# Altium project Altium.PrjPcb
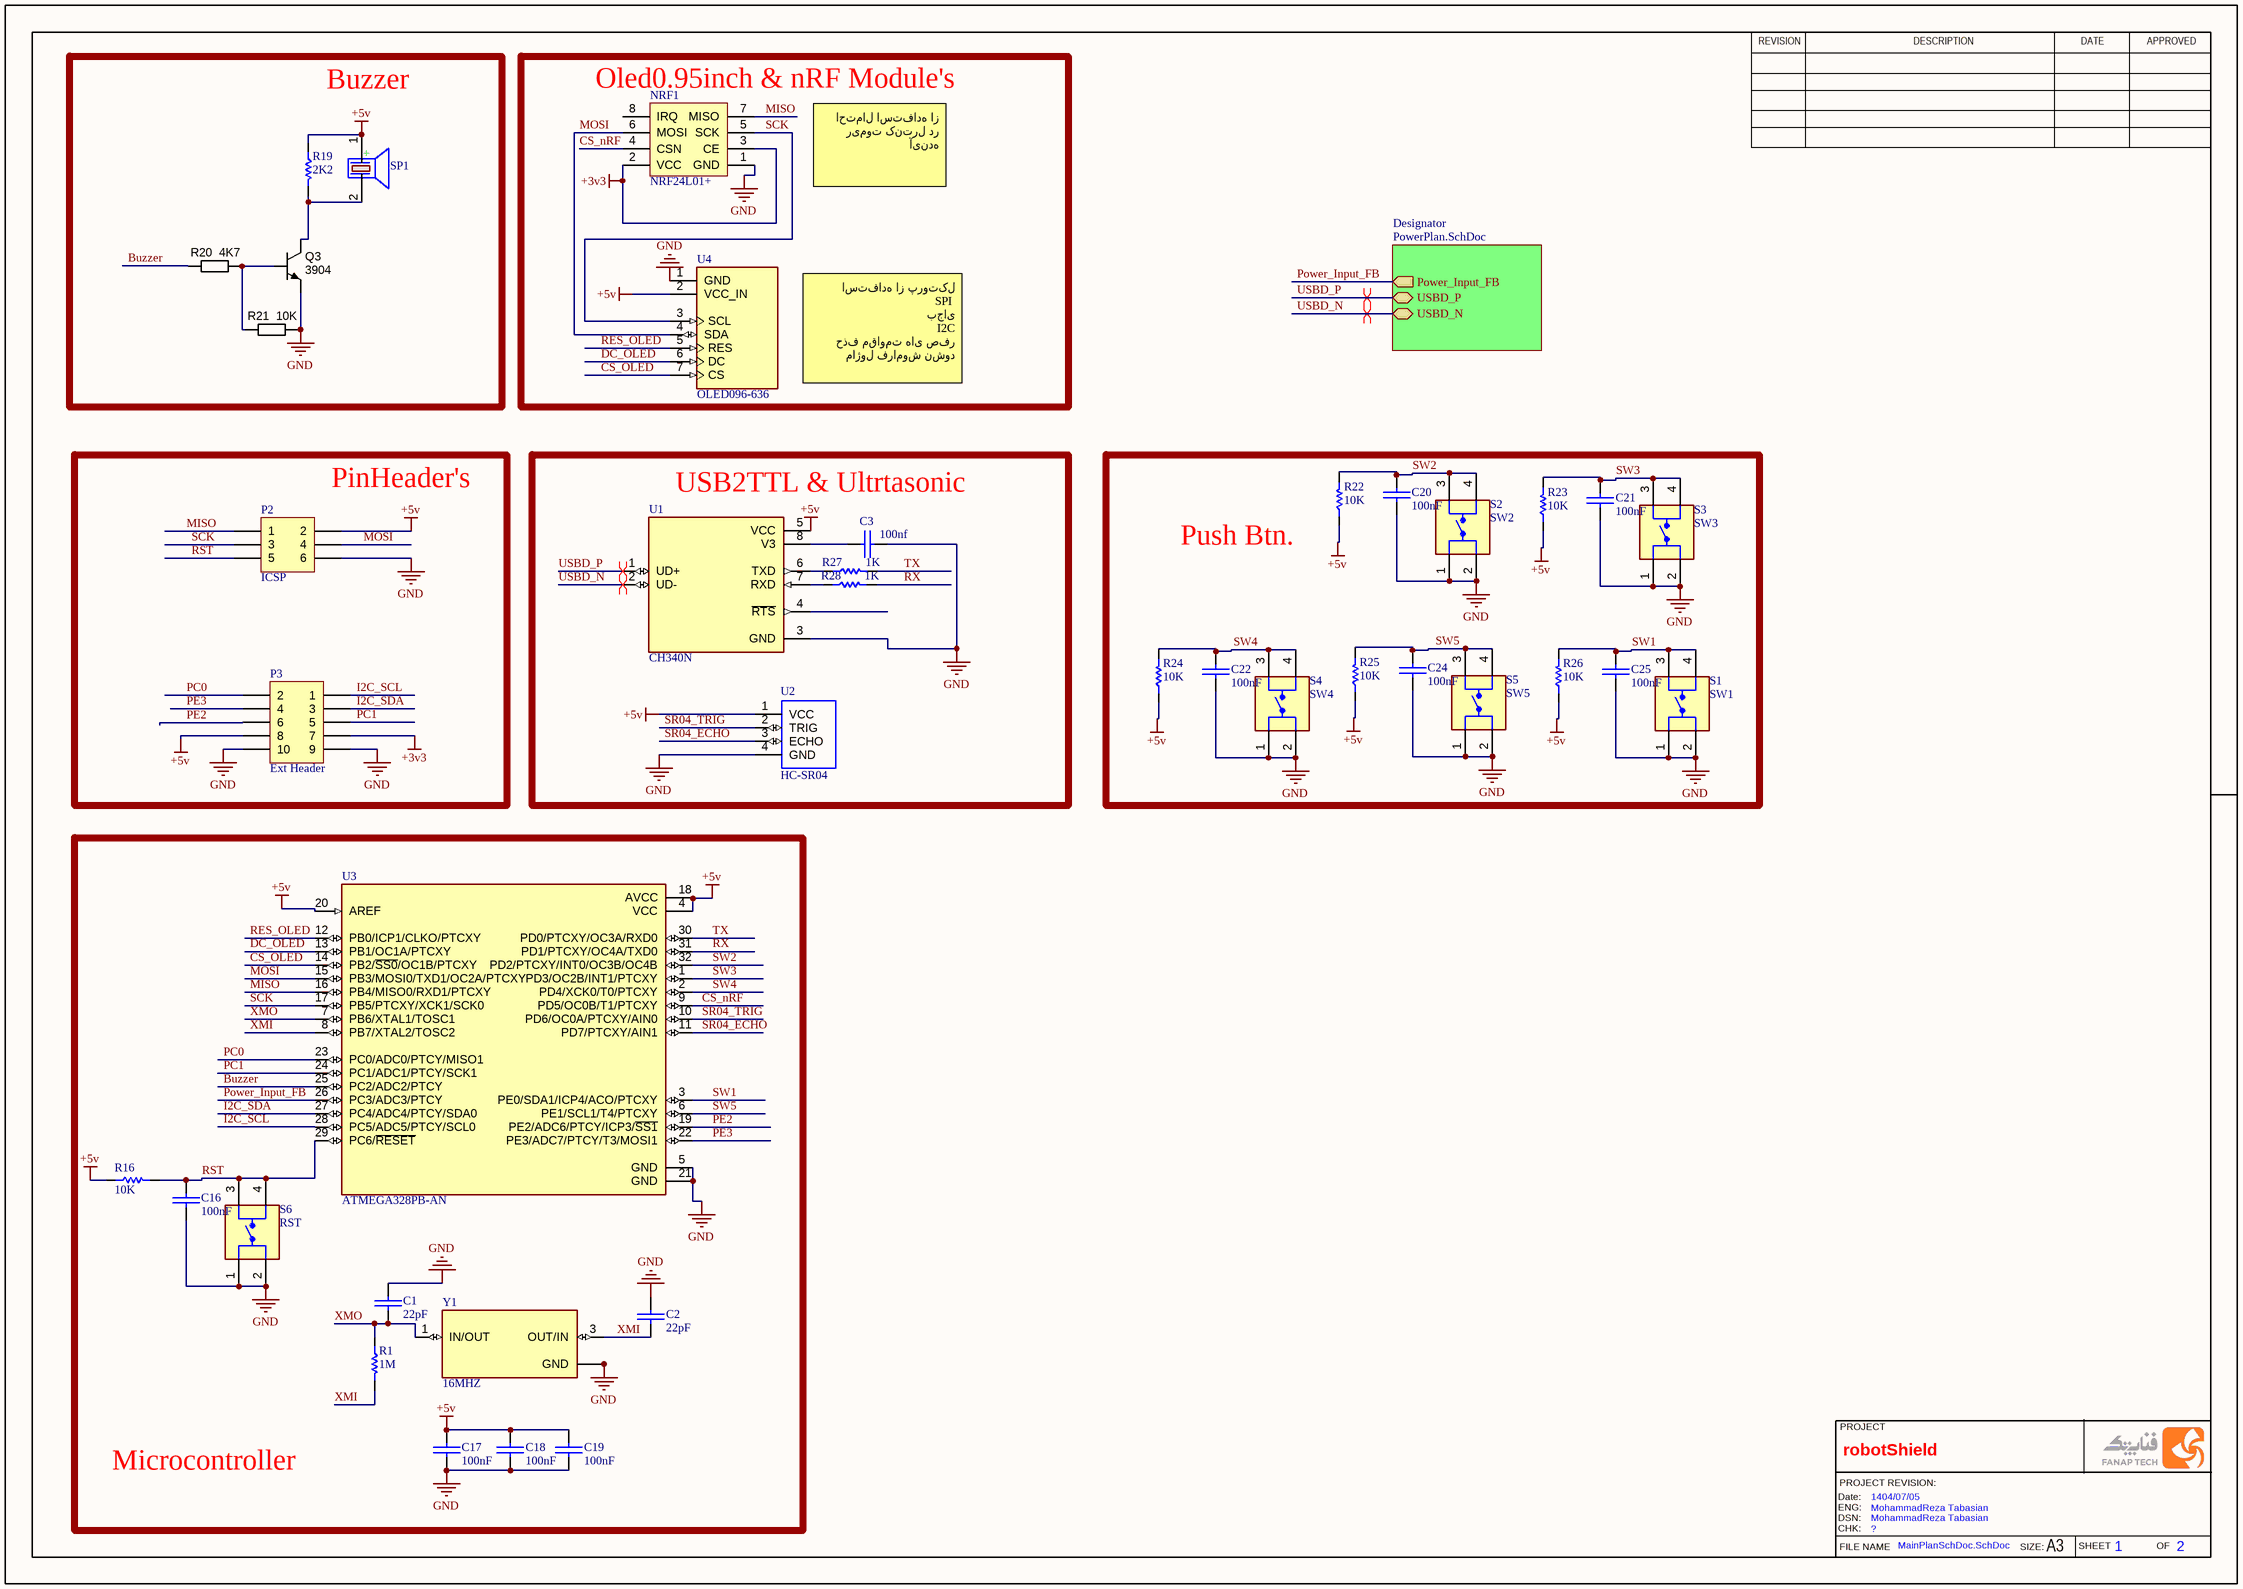
[diagram p0: MainPlanSchDoc.SchDoc]
2 sheets, 85 parts. Net scope: hierarchical (ports join the sheet entries above them; power ports are global).
Board file: robotShield.PcbDoc
Sheets:
  MainPlanSchDoc.SchDoc
    Designator = PowerPlan.SchDoc

## Sheet MainPlanSchDoc.SchDoc
size 420 x 297 mm; Date: 1404/07/05; CheckedBy: ?; DrawnBy: MohammadReza Tabasian; Engineer: MohammadReza Tabasian; SheetNumber: 1; SheetTotal: 2; SheetNumberSPQ: 1; SheetTotalSPQ: 2; Project: robotShield; FileName: MainPlanSchDoc.SchDoc

### Parts
C1  22pF  [C0805]
C2  22pF  [C0805]
C3  100nf  [C0805]
C16  100nF  [C0805]
C17  100nF  [C0805]
C18  100nF  [C0805]
C19  100nF  [C0805]
C20  100nF  [C0805]
C21  100nF  [C0805]
C22  100nF  [C0805]
C24  100nF  [C0805]
C25  100nF  [C0805]
NRF1  NRF24L01+  [NRF24L01P]
P2  ICSP  [HDR2X3]
P3  Ext Header  [HDR2X5]
Q3  3904  [SOT23-3]
R1  1M  [C0805]
R16  10K  [C0805]
R19  2K2  [C0805]
R20  4K7  [C0805]
R21  10K  [C0805]
R22  10K  [C0805]
R23  10K  [C0805]
R24  10K  [C0805]
R25  10K  [C0805]
R26  10K  [C0805]
R27  1K  [C0805]
R28  1K  [C0805]
S1  SW1  [microswitch]
S2  SW2  [microswitch]
S3  SW3  [microswitch]
S4  SW4  [microswitch]
S5  SW5  [microswitch]
S6  RST  [microswitch]
SP1  (no value)  [BUZZER 7.62mm DC]
U1  CH340N  [SOIC_8P_127P600X170-9N]
U2  HC-SR04  [XCVR_HC-SR04]
U3  ATMEGA328PB-AN  [QFP80P900X900X160-32N]
U4  OLED096-636  [OLED096-636]
Y1  16MHZ  [XTAL_3225]

### Blocks framed on the sheet
Buzzer: Q3 R19-R21 SP1
Oled0.95inch & nRF Module's: NRF1 U4
PinHeader's: P2 P3
USB2TTL & Ultrtasonic: C3 R27 R28 U1 U2
Push Btn.: C20-C22 C24 C25 R22-R26 S1-S5
Microcontroller: C1 C2 C16-C19 R1 R16 S6 U3 Y1

### Sub-sheets
Designator = PowerPlan.SchDoc: Power_Input_FB (out), USBD_P (bidir), USBD_N (bidir)

### Nets
+3v3: NRF1.2(VCC) NRF1.3(CE) P3.7
+5v: C17.1(+) C18.1(+) C19.1(+) P2.2 P3.8 R16.1 R19.1 R22.1 R23.1 R24.1 R25.1 R26.1 SP1.1(+) U1.5(VCC) U2.1(VCC) U3.4(VCC) U3.18(AVCC) U3.20(AREF) U4.2(VCC_IN)
GND: C1.1(+) C2.1(+) C3.2(-) C16.2(-) C17.2(-) C18.2(-) C19.2(-) C20.2(-) C21.2(-) C22.2(-) C24.2(-) C25.2(-) NRF1.1(GND) P2.6 P3.9 P3.10 Q3.2(E) R21.2 S1.1 S1.2 S2.1 S2.2 S3.1 S3.2 S4.1 S4.2 S5.1 S5.2 S6.1 S6.2 U1.3(GND) U2.4(GND) U3.5(GND) U3.21(GND) U4.1(GND) Y1.2(GND) Y1.4(GND)
Buzzer: R20.1 U3.25(PC2/ADC2/PTCY)
CS_nRF: NRF1.4(CSN) U3.9(PD5/OC0B/T1/PTCXY)
CS_OLED: U3.14(PB2/~{SS0}/OC1B/PTCXY) U4.7(CS)
DC_OLED: U3.13(PB1/OC1A/PTCXY) U4.6(DC)
I2C_SCL: P3.1 U3.28(PC5/ADC5/PTCY/SCL0)
I2C_SDA: P3.3 U3.27(PC4/ADC4/PTCY/SDA0)
MISO: NRF1.7(MISO) P2.1 U3.16(PB4/MISO0/RXD1/PTCXY)
MOSI: NRF1.6(MOSI) P2.4 U3.15(PB3/MOSI0/TXD1/OC2A/PTCXY) U4.4(SDA)
PC0: P3.2 U3.23(PC0/ADC0/PTCY/MISO1)
PC1: P3.5 U3.24(PC1/ADC1/PTCY/SCK1)
PE2: P3.6 U3.19(PE2/ADC6/PTCY/ICP3/~{SS1})
PE3: P3.4 U3.22(PE3/ADC7/PTCY/T3/MOSI1)
Power_Input_FB: U3.26(PC3/ADC3/PTCY) ; sheet Designator/Power_Input_FB
RES_OLED: U3.12(PB0/ICP1/CLKO/PTCXY) U4.5(RES)
RST: C16.1(+) P2.5 R16.2 S6.3 S6.4 U3.29(PC6/~{RESET})
RX: R28.2 U3.31(PD1/PTCXY/OC4A/TXD0)
SCK: NRF1.5(SCK) P2.3 U3.17(PB5/PTCXY/XCK1/SCK0) U4.3(SCL)
SR04_ECHO: U2.3(ECHO) U3.11(PD7/PTCXY/AIN1)
SR04_TRIG: U2.2(TRIG) U3.10(PD6/OC0A/PTCXY/AIN0)
SW1: C25.1(+) R26.2 S1.3 S1.4 U3.3(PE0/SDA1/ICP4/ACO/PTCXY)
SW2: C20.1(+) R22.2 S2.3 S2.4 U3.32(PD2/PTCXY/INT0/OC3B/OC4B)
SW3: C21.1(+) R23.2 S3.3 S3.4 U3.1(PD3/OC2B/INT1/PTCXY)
SW4: C22.1(+) R24.2 S4.3 S4.4 U3.2(PD4/XCK0/T0/PTCXY)
SW5: C24.1(+) R25.2 S5.3 S5.4 U3.6(PE1/SCL1/T4/PTCXY)
TX: R27.2 U3.30(PD0/PTCXY/OC3A/RXD0)
USBD_N: U1.2(UD-) ; sheet Designator/USBD_N
USBD_P: U1.1(UD+) ; sheet Designator/USBD_P
XMI: C2.2(-) R1.2 U3.8(PB7/XTAL2/TOSC2) Y1.3(OUT/IN)
XMO: C1.2(-) R1.1 U3.7(PB6/XTAL1/TOSC1) Y1.1(IN/OUT)
NetC3_1: C3.1(+) U1.8(V3)
NetQ3_1: Q3.1(B) R20.2 R21.1
NetQ3_3: Q3.3(C) R19.2 SP1.2(-)
NetR27_1: R27.1 U1.6(TXD)
NetR28_1: R28.1 U1.7(RXD)

Not connected (* = marked no-connect by the designer): NRF1 8(IRQ); U1 4(~{RTS})

### Layout directives
differential pair: USBD_N, USBD_P

### Notes on the sheet
- احتمال استفاده از ریموت کنترل در آینده
- استفاده از پروتکل
  SPI
  بجای
  I2C
  حذف مقاومت های صفر ماژول فراموش نشود
- REVISION
- DESCRIPTION
- DATE
- APPROVED
- PROJECT
- FILE NAME
- PROJECT REVISION:
- Date:
- ENG:
- DSN:
- CHK:
- SIZE:
- SHEET
- OF
- A3

### Library data of the parts
C1-C3 C16-C22 C24 C25 = Cap-Bipolar: Bipolar Capacitor; Voltage: 100V; Designer: Saeid Jorablo; Organazation: ControTec; Adding Date: 1387/12/20
NRF1 = NRF24L01P: RF Module; Ali Hafizi: Creature
P2 = Header 3X2: Header, 3-Pin, Dual row; LatestRevisionDate: 17-Jul-2002; LatestRevisionNote: Re-released for DXP Platform.; Publisher: Altium Limited
P3 = Header 5X2: Header, 5-Pin, Dual row; LatestRevisionDate: 17-Jul-2002; LatestRevisionNote: Re-released for DXP Platform.; Publisher: Altium Limited
Q3 = NPN_MMBT3904: Transistor SMD NPN 40V 0.2A 250mW SOT-23; Manufacturer 1: Fairchild Semiconductor; Ratings: 40V; 200mA; 250mW; Material: Si; SCDType: source; Package / Case: SOT-23; Supplier 1: Digi-Key; Supplier Part Number 1: MMBT3904FSCT-ND; Transistor Type: NPN; Mounting Type: Surface Mount; Supplier 2: Digi-Key; Supplier Part Number 2: 568-1741-1-ND; Manufacturer 2: NXP Semiconductors; Manufacturer Part Number 2: PMBT3904,215; ComponentLink2URL: http://www.nxp.com/documents/data_sheet/PMBT3904.pdf; ComponentLink2Description: http://www.nxp.com/documents/data_sheet/PMBT3904.pdf; ComponentLink1URL: http://www.fairchildsemi.com/ds/MM/MMBT3904.pdf; ComponentLink1Description: http://www.fairchildsemi.com/ds/MM/MMBT3904.pdf; Manufacturer Part Number 1: 3904
R1 R16 R19 R22-R28 = Resistor
R20 R21 = RES_0R_0805: Resistor SMD 0805; Manufacturer 1: Samsung Electro-Mechanics America, Inc; Manufacturer Part Number 1: RC2012J000CS; Ratings: 1/8W; SCDType: spec; Tolerance: N/A; Package / Case: 0805 (2012 metric); Supplier 1: Digi-Key; Supplier Part Number 1: 1276-5466-6-ND; RoHS 1: RoHS Compliant; ComponentLink1URL: http://www.samsungsem.com/servlet/FileDownload?filename=productcatalog/pdf/Chip_Resistor.pdf; ComponentLink1Description: http://www.samsungsem.com/servlet/FileDownload?filename=productcatalog/pdf/Chip_Resistor.pdf; Supplier 2: Digi-Key; Supplier Part Number 2: RMCF0805ZT0R00DKR-ND; Manufacturer 2: Stackpole Electronics Inc; Manufacturer Part Number 2: RMCF0805ZT0R00; RoHS 2: RoHS Compliant; ComponentLink2URL: http://www.seielect.com/Catalog/SEI-RMCF_RMCP.pdf; ComponentLink2Description: http://www.seielect.com/Catalog/SEI-RMCF_RMCP.pdf; Supplier 3: Digi-Key; Supplier Part Number 3: 311-0.0ARDKR-ND; Manufacturer 3: Yageo; Manufacturer Part Number 3: RC0805JR-070RL; RoHS 3: RoHS Compliant; ComponentLink3URL: http://media.digikey.com/pdf/Data%20Sheets/Yageo%20PDFs/RC0805%20Pb%20Free.pdf; ComponentLink3Description: http://media.digikey.com/pdf/Data%20Sheets/Yageo%20PDFs/RC0805%20Pb%20Free.pdf; Supplier 4: Digi-Key; Supplier Part Number 4: P0.0ADKR-ND; Manufacturer 4: Panasonic Electronic Components; Manufacturer Part Number 4: ERJ-6GEY0R00V; RoHS 4: RoHS Compliant; ComponentLink4URL: http://industrial.panasonic.com/www-cgi/jvcr13pz.cgi?E+PZ+3+AOA0001+ERJ6GEY0R00V+7+WW; ComponentLink4Description: http://industrial.panasonic.com/www-cgi/jvcr13pz.cgi?E+PZ+3+AOA0001+ERJ6GEY0R00V+7+WW; Supplier 5: Digi-Key; Supplier Part Number 5: RHM0.0CPDKR-ND; Manufacturer 5: Rohm Semiconductor; Manufacturer Part Number 5: MCR10ERTJ000; RoHS 5: RoHS Compliant; ComponentLink5URL: http://rohmfs.rohm.com/en/products/databook/datasheet/passive/resistor/chip_resistor/mcr_g.pdf; ComponentLink5Description: http://rohmfs.rohm.com/en/products/databook/datasheet/passive/resistor/chip_resistor/mcr_g.pdf
S1-S6 = Switch_Push_Button: Tactile Switch SPST-NO Top Actuated Surface Mount; MP: PTS525SM15SMTR2 LFS; MF: C&K; Package: Tactile Switch CK; SnapEDA_Link: https://www.snapeda.com/parts/PTS525SM15SMTR2%20LFS/C%2526K/view-part/?ref=snap; Purchase-URL: https://pricing.snapeda.com/search/part/PTS525SM15SMTR2 LFS/?ref=eda; Check_prices: https://www.snapeda.com/parts/PTS525SM15SMTR2%20LFS/C%2526K/view-part/?ref=eda; Availability: In Stock; Value: *; Price: None
SP1 = PIEZO BUZZER: PIEZO BUZZER ACTIVE; Designer: Abbas Basereh; Comment_1: SPEAKER AND BEEP; Design Date: 1395/11/14; ComponentLink2Description: Reference; PackageDescription: THD; Publisher: Abbas Basereh; Mounting Technology: THD; Pin Count: 2; Status: Unreleased
U1 = CH340N: USB to Serial Port Chip; MF: WCH; SnapEDA_Link: https://www.snapeda.com/parts/CH340N/WCH/view-part/?ref=snap; Package: Package; Value: *; MP: CH340N; Check_prices: https://www.snapeda.com/parts/CH340N/WCH/view-part/?ref=eda
U2 = HC-SR04: Ultrasonic Sensor Module; Availability: Unavailable; MP: HC-SR04; Value: *; Price: None; Package: None
U3 = ATMEGA328PB-AN: AVR AVRÂ® ATmega, Functional Safety (FuSa) Microcontroller IC 8-Bit 20MHz 32KB (16K x 16) FLASH 32-TQFP (7x7); MF: Microchip Technology; MP: ATMEGA328PBAN; SnapEDA_Link: https://www.snapeda.com/parts/ATMEGA328PBAN/Microchip+Technology/view-part/?ref=snap; Package: None; Value: *; Check_prices: https://www.snapeda.com/parts/ATMEGA328PBAN/Microchip+Technology/view-part/?ref=eda
U4 = OLED096-636: 0.96 128 X 64 MONOCHROME GRAPHIC OLED DISPLAY MODULE - SPI- I2C; MP: DM-OLED096-636; SnapEDA_Link: https://www.snapeda.com/parts/DM-OLED096-636/Display+Module/view-part/?ref=snap; Package: Package; Value: *; MF: Display Module; Check_prices: https://www.snapeda.com/parts/DM-OLED096-636/Display+Module/view-part/?ref=eda
Y1 = Crystal 3225: Crystals 25.0000MHZ 6PF SMD ECX-33B2 +/-2 ppm Aging 3225 4-SMD RoHS; MF: ECS; MP: ECS-250-6-33B2-CTN-TR3; SnapEDA_Link: https://www.snapeda.com/parts/ECS-250-6-33B2-CTN-TR3/ECS/view-part/?ref=snap; Package: ECS-33B2-33B2-4 ECS; Value: *; Check_prices: https://www.snapeda.com/parts/ECS-250-6-33B2-CTN-TR3/ECS/view-part/?ref=eda

## Sheet PowerPlan.SchDoc
size 420 x 297 mm; Project: robotShield; SheetNumberSPQ: 2; SheetTotalSPQ: 2; FileName: PowerPlan; Date: 1404/07/05; CheckedBy: ?; DrawnBy: MohammadReza Tabasian; Engineer: MohammadReza Tabasian; SheetNumber: 2; SheetTotal: 2
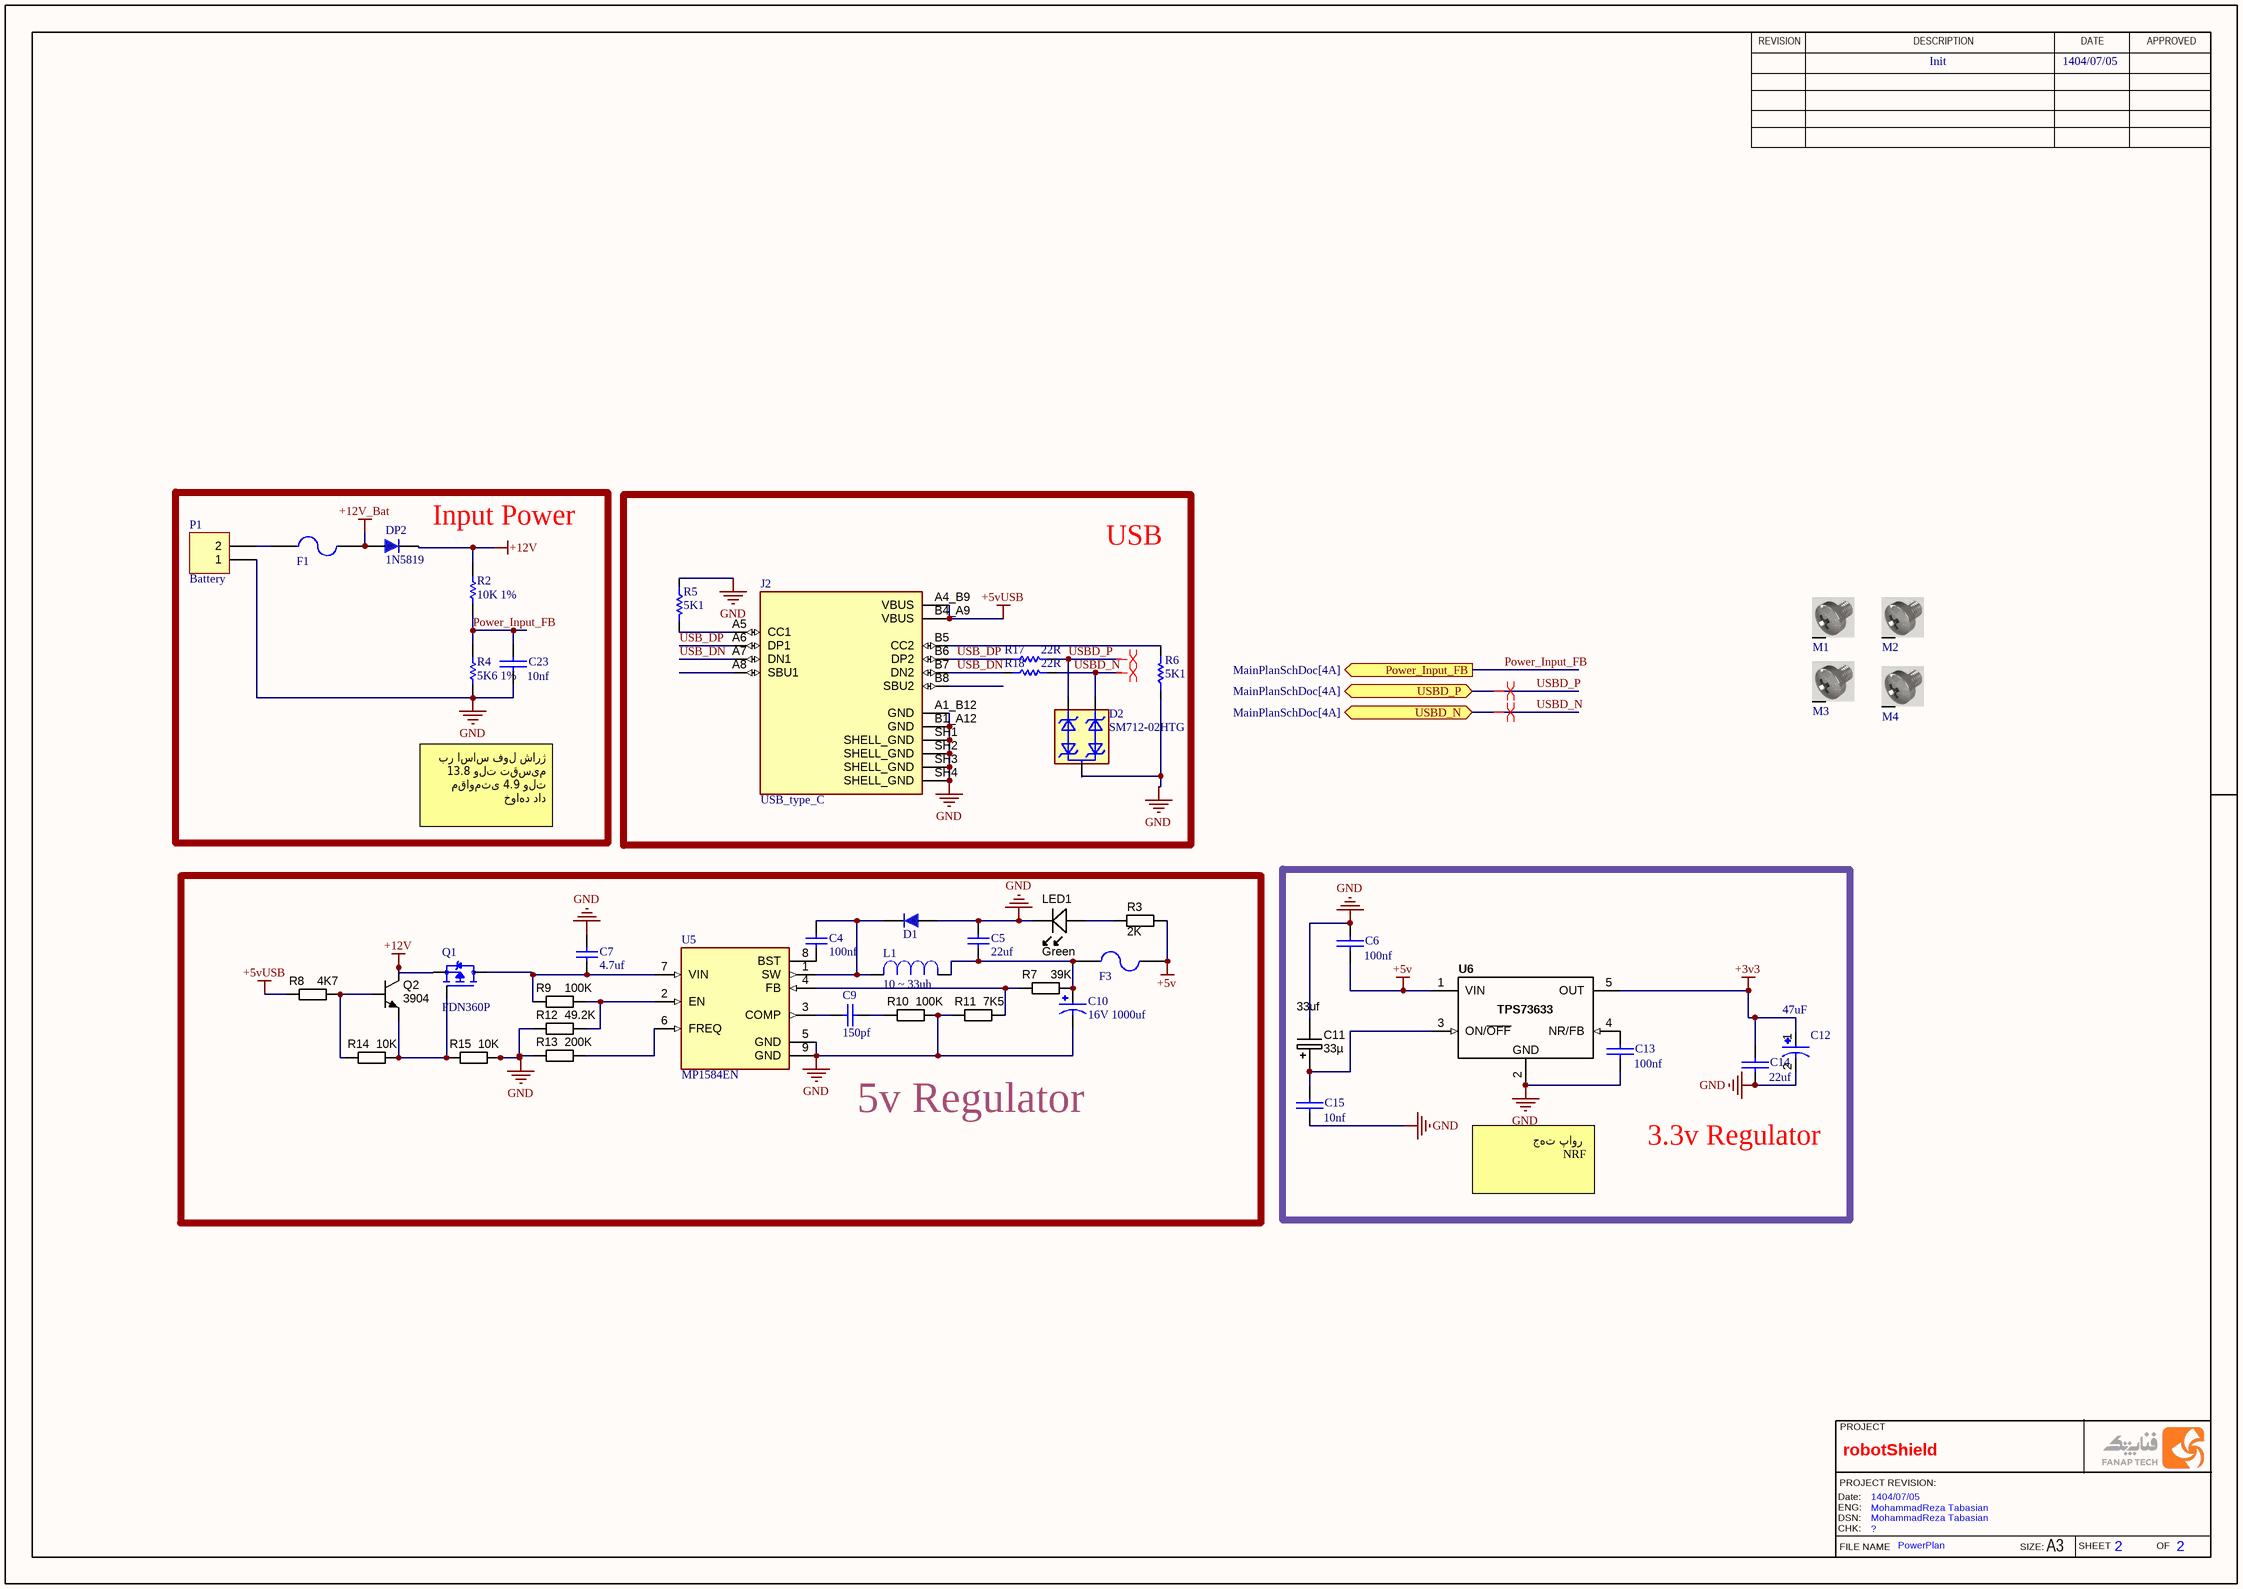
[diagram p1: PowerPlan.SchDoc]

### Parts
C4  100nf  [C0805]
C5  22uf  [C1206]
C6  100nf  [C0805]
C7  4.7uf  [C1206]
C9  150pf  [C0805]
C10  16V 1000uf  [CAP_SMD13*13]
C11  33uf  value 33µ  [CAPMP6032X280N]
C12  47uF  [CAPMP7343X430N]
C13  100nf  [C0805]
C14  22uf  [C1206]
C15  10nf  [C0805]
C23  10nf  [C0805]
D1  SS34  [DIOM4629X24N]  (value not drawn)
D2  SM712-02HTG  [SOT23]
DP2  1N5819  [430X270D]
F1  F300ma  [1206 FUSE]  (value not drawn)
F3  F300ma  [1206 FUSE]  (value not drawn)
J2  USB_type_C  [USB_type_C]
L1  10 ~ 33uh  [IND_7*7]
LED1  Color: Green  [LED-0805-K]  (hidden comment: LED)
M1  Screw  [Board Screw_No Silk]  (value not drawn)
M2  Screw  [Board Screw_No Silk]  (value not drawn)
M3  Screw  [Board Screw_No Silk]  (value not drawn)
M4  Screw  [Board Screw_No Silk]  (value not drawn)
P1  Battery  [HDR1X2]
Q1  FDN360P  [SOT95P251X112-3N]
Q2  3904  [SOT23-3]
R2  10K 1%  [C0805]
R3  2K  [C0805]
R4  5K6 1%  [C0805]
R5  5K1  [C0805]
R6  5K1  [C0805]
R7  39K  [C0805]
R8  4K7  [C0805]
R9  100K  [C0805]
R10  100K  [C0805]
R11  7K5  [C0805]
R12  49.2K  [C0805]
R13  200K  [C0805]
R14  10K  [C0805]
R15  10K  [C0805]
R17  22R  [C0805]
R18  22R  [C0805]
U5  MP1584EN  [SOIC_8P_127P600X170-9N]
U6  3.3V  [SOT23-5]  (value not drawn)

### Blocks framed on the sheet
Input Power: C23 DP2 F1 P1 R2 R4
USB: D2 J2 R5 R6 R17 R18
5v Regulator: C4 C5 C7 C9 C10 D1 F3 L1 LED1 Q1 Q2 R3 R7-R15 U5
3.3v Regulator: C6 C11-C15 U6

### Ports
Power_Input_FB (out, see MainPlanSchDoc[4A]), USBD_N (bidir, see MainPlanSchDoc[4A]), USBD_P (bidir, see MainPlanSchDoc[4A])

### Nets
+3v3: C12.1 C14.1(+) U6.5(OUT)
+5v: C6.2(-) F3.2 R3.1 U6.1(VIN)
+5vUSB: J2.A4_B9(VBUS) J2.B4_A9(VBUS) R8.1
+12V: DP2.2 Q1.2(S) Q2.3(C) R2.2
+12V_Bat: DP2.1 F1.2
GND: C5.1 C6.1(+) C7.2 C10.2 C11.2 C12.2 C13.2(-) C14.2(-) C15.2(-) C23.2(-) D1.1 D2.3 J2.A1_B12(GND) J2.B1_A12(GND) J2.SH1(SHELL_GND) J2.SH2(SHELL_GND) J2.SH3(SHELL_GND) J2.SH4(SHELL_GND) LED1.K P1.1 R4.1 R5.1 R6.1 R10.2 R11.1 R12.1 R13.1 R15.2 U5.5(GND) U5.9(GND) U6.2(GND)
Power_Input_FB: C23.1(+) R2.1 R4.2 ; port Power_Input_FB
USB_DN: J2.A7(DN1) J2.B7(DN2) R18.1
USB_DP: J2.A6(DP1) J2.B6(DP2) R17.1
USBD_N: D2.1 R18.2 ; port USBD_N
USBD_P: D2.2 R17.2 ; port USBD_P
NetC4_1: C4.1 D1.2 L1.2 U5.1(SW)
NetC4_2: C4.2 U5.8(BST)
NetC5_2: C5.2 C10.1 F3.1 L1.1 R7.2
NetC7_1: C7.1 Q1.3(D) R9.1 U5.7(VIN)
NetC9_1: C9.1 R10.1
NetC9_2: C9.2 U5.3(COMP)
NetC11_1: C11.1 C15.1(+) U6.3(ON/~{OFF})
NetC13_1: C13.1(+) U6.4(NR/FB)
NetF1_1: F1.1 P1.2
NetJ2_A5: J2.A5(CC1) R5.2
NetJ2_B5: J2.B5(CC2) R6.2
NetLED1_A: LED1.A R3.2
NetQ1_1: Q1.1(G) Q2.2(E) R14.2 R15.1
NetQ2_1: Q2.1(B) R8.2 R14.1
NetR7_1: R7.1 R11.2 U5.4(FB)
NetR9_2: R9.2 R12.2 U5.2(EN)
NetR13_2: R13.2 U5.6(FREQ)

Not connected (* = marked no-connect by the designer): J2 A8(SBU1) B8(SBU2); M1 S; M2 S; M3 S; M4 S

### Layout directives
differential pair: USBD_N, USBD_P

### Notes on the sheet
- Init
- 1404/07/05
- بر اساس فول شارژ 13.8 ولت تقسیم مقاومتی 4.9 ولت خواهد داد
- جهت پاور
  NRF
- REVISION
- DESCRIPTION
- DATE
- APPROVED
- PROJECT
- FILE NAME
- PROJECT REVISION:
- Date:
- ENG:
- DSN:
- CHK:
- SIZE:
- SHEET
- OF
- A3
- (in symbol LinREG_3V3_400mA_TPS73633DBV) TPS73633

### Library data of the parts
C4 C9 = CAP SMD 0805: CAP 0805; Designer: Abbas Basereh; Desc.: CAP SMD 0805; Data: 16-12-2016
C5 C7 = CAP SMD 1206: CAP 1206; Designer: Abbas Basereh; Desc.: CAP SMD 1206; Data: 16-12-2016
C6 C13-C15 C23 = Cap-Bipolar: as C1 on sheet MainPlanSchDoc; Adding Date: 1387/12/20
C10 = CAP_SMD13*13: CAP ALUM 470UF 20% 35V SMD; MF: Panasonic Electronic Components; MP: EEE-FN1V471UP; Check_prices: https://www.snapeda.com/parts/EEE-FN1V471UP/Panasonic/view-part/6178317/?ref=eda; SnapEDA_Link: https://www.snapeda.com/parts/EEE-FN1V471UP/Panasonic/view-part/6178317/?ref=snap; Availability: In Stock; Package: RADIAL-2 Panasonic; Price: None; Value: *
C11 = CAPT_33u_3216_6V3: Capacitor SMD Tantalum 33uF 10% 6.3V 3216-18; Manufacturer 1: Kemet; Manufacturer Part Number 1: T491A336K006AT; Material: Solid Tantalum; SCDType: source; Package / Case: EIA 535BAAC size A; Ratings: 6.3V; Tolerance: ±10%; ComponentLink2URL: http://www.avx.com/docs/Catalogs/tcj.pdf; ComponentLink2Description: http://www.avx.com/docs/Catalogs/tcj.pdf; Supplier 1: Digi-Key; Supplier Part Number 1: 399-9716-1-ND; ComponentLink1URL: http://capacitoredge.kemet.com/capedge2/DataSheet?pn=T491A336K006AT; ComponentLink1Description: http://capacitoredge.kemet.com/capedge2/DataSheet?pn=T491A336K006AT; Supplier 2: Digi-Key; Supplier Part Number 2: 478-1666-1-ND; Manufacturer 2: AVX Corporation; Manufacturer Part Number 2: TAJA336K006RNJ; Manufacturer 4: Samsung Electro-Mechanics; Manufacturer Part Number 4: TCSCS0J336KAAR; ComponentLink4URL: http://components.arrow.com/partservice/dataview/altium/51540102S9917798N4139?apiKey=aa438727d59eed98c4bed826d8d949c84cb5e685b92bf87346a0226bd2658797; ComponentLink4Description: http://components.arrow.com/partservice/dataview/altium/51540102S9917798N4139?apiKey=aa438727d59eed98c4bed826d8d949c84cb5e685b92bf87346a0226bd2658797; Supplier 3: Digi-Key; Supplier Part Number 3: 293D336X96R3A2TE3-ND; Manufacturer Part Number 3: 293D336X96R3A2TE3; Manufacturer 3: Vishay Sprague; ComponentLink3URL: http://www.vishay.com/doc?40002; ComponentLink3Description: http://www.vishay.com/doc?40002; Supplier 4: Arrow; Supplier Part Number 4: 51540102S9917798N4139
C12 = T541X107M025AH6510: Cap, Tant, 470uf, 10v, Case x; MF: KEMET; Check_prices: https://www.snapeda.com/parts/T541X107M025AH6510/KEMET/view-part/?ref=eda; Purchase-URL: https://pricing.snapeda.com/search/part/T541X107M025AH6510/?ref=eda; Value: *; MP: T541X107M025AH6510; SnapEDA_Link: https://www.snapeda.com/parts/T541X107M025AH6510/KEMET/view-part/?ref=snap; Availability: In Stock; Price: None; Package: SMD-2 KEMET
D1 = 1n4007 SMD M7: Standard Rectifiers; Part. No: M7; Manufacturer: DC COMPONENTS; Designer: Abbas Basereh; Link: http://www.tme.eu/en/details/m7/smd-universal-diodes/dc-components/; Link: https://www.aliexpress.com/item/Smd-tube-1n4007-m7-SMA/1213719741.html?spm=2114.01010208.3.1.ZyZ7bC&ws_ab_test=searchweb0_0,searchweb201602_4_10065_10068_10084_10083_10080_10082_10081_10060_10061_10062_10056_10055_10054_10059_10099_10078_10079_427_10073_10103_10102_10096_10052_10050_10051,searchweb201603_4&btsid=db2be5ca-e560-400a-b91c-484ab5ee228b; Data: 16-12-2016
D2 = SM712-02HTG: TVS Diode, SM712 Series, 31V Clamp, 600W Peak Pulse, Surface Mount, SOT23-3 | Littelfuse SM712-02HTG; SnapEDA_Link: https://www.snapeda.com/parts/SM712-02HTG/Ersa/view-part/?ref=snap; Package: TO-236 Littelfuse; Value: *; MF: Littelfuse; MP: SM712-02HTG; Check_prices: https://www.snapeda.com/parts/SM712-02HTG/Ersa/view-part/?ref=eda
DP2 = 1N5819: Schottkey Rectifiers; Designer: Abbas Basereh; Data: 16-12-2016; Link: *; Part. No: *
F1 F3 = Fuse SMD1206: SMD Fuses 1206; Designer: Abbas Basereh; Desc.: SMD Fuses 1206; Data: 16-12-2016
J2 = USB_type_C: MF: {'manufacturer': u'GCT'}; MP: USB4105-GF-A; Package: None; Price: None; Value: *; Availability: Unavailable
L1 = Inductor 100uh: 100ÂµH Shielded Wirewound Inductor 1.96A 163mOhm Nonstandard; MF: Eaton; MP: DR127-101-R; Package: Nonstandard Eaton; Price: None; SnapEDA_Link: https://www.snapeda.com/parts/DR127-101-R/Eaton/view-part/2755655/?ref=snap; Value: *; Availability: Unavailable
LED1 = LED_SMD_Green_0805_6mcd: LED, 0805 SMD, Green; Manufacturer 1: LITE-ON; Manufacturer Part Number 1: LTST-C171GKT; Material: GaP; Ratings: 6 mcd; 569 nm; SCDType: source; Package / Case: 0805; Supplier 1: Digi-Key; Supplier Part Number 1: 160-1423-1-ND; Value: Green
M1-M4 = Board Screw: Board Screw With Spacer
P1 = Header 2: Header, 2-Pin; LatestRevisionDate: 17-Jul-2002; LatestRevisionNote: Re-released for DXP Platform.; Publisher: Altium Limited
Q1 = FDN360P: P-Channel 30V 2A (Ta) 500mW (Ta) Surface Mount SuperSOT-3; MF: ON; Value: *; Package: TO-236-3 ON; Check_prices: https://www.snapeda.com/parts/FDN360P/Onsemi/view-part/?ref=eda; Price: None; MP: FDN360P; Availability: In Stock; SnapEDA_Link: https://www.snapeda.com/parts/FDN360P/Onsemi/view-part/?ref=snap; Purchase-URL: https://pricing.snapeda.com/search/part/FDN360P/?ref=eda
Q2 = NPN_MMBT3904: as Q3 on sheet MainPlanSchDoc; Package / Case: SOT-23; Supplier 1: Digi-Key; Supplier Part Number 1: MMBT3904FSCT-ND; Transistor Type: NPN; Mounting Type: Surface Mount; Supplier 2: Digi-Key; Supplier Part Number 2: 568-1741-1-ND; Manufacturer 2: NXP Semiconductors; Manufacturer Part Number 2: PMBT3904,215; ComponentLink2URL: http://www.nxp.com/documents/data_sheet/PMBT3904.pdf; ComponentLink2Description: http://www.nxp.com/documents/data_sheet/PMBT3904.pdf; ComponentLink1URL: http://www.fairchildsemi.com/ds/MM/MMBT3904.pdf; ComponentLink1Description: http://www.fairchildsemi.com/ds/MM/MMBT3904.pdf; Manufacturer Part Number 1: 3904
R2 R4 = RES 1206 0.25W: RES 1206; Designer: Abbas Basereh; Desc.: RES SMD 1206; Data: 16-12-2016
R3 R7-R15 = RES_0R_0805: as R20 on sheet MainPlanSchDoc; Tolerance: N/A; Package / Case: 0805 (2012 metric); Supplier 1: Digi-Key; Supplier Part Number 1: 1276-5466-6-ND; RoHS 1: RoHS Compliant; ComponentLink1URL: http://www.samsungsem.com/servlet/FileDownload?filename=productcatalog/pdf/Chip_Resistor.pdf; ComponentLink1Description: http://www.samsungsem.com/servlet/FileDownload?filename=productcatalog/pdf/Chip_Resistor.pdf; Supplier 2: Digi-Key; Supplier Part Number 2: RMCF0805ZT0R00DKR-ND; Manufacturer 2: Stackpole Electronics Inc; Manufacturer Part Number 2: RMCF0805ZT0R00; RoHS 2: RoHS Compliant; ComponentLink2URL: http://www.seielect.com/Catalog/SEI-RMCF_RMCP.pdf; ComponentLink2Description: http://www.seielect.com/Catalog/SEI-RMCF_RMCP.pdf; Supplier 3: Digi-Key; Supplier Part Number 3: 311-0.0ARDKR-ND; Manufacturer 3: Yageo; Manufacturer Part Number 3: RC0805JR-070RL; RoHS 3: RoHS Compliant; ComponentLink3URL: http://media.digikey.com/pdf/Data%20Sheets/Yageo%20PDFs/RC0805%20Pb%20Free.pdf; ComponentLink3Description: http://media.digikey.com/pdf/Data%20Sheets/Yageo%20PDFs/RC0805%20Pb%20Free.pdf; Supplier 4: Digi-Key; Supplier Part Number 4: P0.0ADKR-ND; Manufacturer 4: Panasonic Electronic Components; Manufacturer Part Number 4: ERJ-6GEY0R00V; RoHS 4: RoHS Compliant; ComponentLink4URL: http://industrial.panasonic.com/www-cgi/jvcr13pz.cgi?E+PZ+3+AOA0001+ERJ6GEY0R00V+7+WW; ComponentLink4Description: http://industrial.panasonic.com/www-cgi/jvcr13pz.cgi?E+PZ+3+AOA0001+ERJ6GEY0R00V+7+WW; Supplier 5: Digi-Key; Supplier Part Number 5: RHM0.0CPDKR-ND; Manufacturer 5: Rohm Semiconductor; Manufacturer Part Number 5: MCR10ERTJ000; RoHS 5: RoHS Compliant; ComponentLink5URL: http://rohmfs.rohm.com/en/products/databook/datasheet/passive/resistor/chip_resistor/mcr_g.pdf; ComponentLink5Description: http://rohmfs.rohm.com/en/products/databook/datasheet/passive/resistor/chip_resistor/mcr_g.pdf
R5 R6 R17 R18 = Resistor
U5 = MP1584EN: Buck Switching Regulator IC Positive Adjustable 0.8V 1 Output 3A 8-SOIC _0.154, 3.90mm Width_ Exposed Pad; MF: Monolithic Power; MP: MP1584EN; Value: *; Package: SOIC-8 Monolithic Power; SnapEDA_Link: https://www.snapeda.com/parts/MP1584EN/Monolithic%20Power%20Systems%20Inc./view-part/891721/?ref=snap; Price: None; Availability: Unavailable
U6 = LinREG_3V3_400mA_TPS73633DBV: IC LDO Regulator 3.3V 400mA SOT23-5 SMD; Manufacturer 1: Texas Instruments; Manufacturer Part Number 1: TPS73633DBVT; Voltage Regulator Type: Switching Buck; Tolerance: ±0.5%; Ratings: 5.5Vin Max; Value: 3.3V; 400mA; Regulator Topology: Positive Fixed; Voltage - Input: 3.5V to 5.5V; Voltage - Dropout (Typical): 0.075V @ 400mA; Current - Output: 400mA (Max); SCDType: spec; Package / Case: SOT23-5; Supplier 1: Digi-Key; Supplier Part Number 1: 296-15819-1-ND; Voltage - Output: 3.3V; Current - Limit (Min): 400mA; ComponentLink1URL: http://www.ti.com/lit/ds/symlink/tps73601.pdf; ComponentLink1Description: http://www.ti.com/lit/ds/symlink/tps73601.pdf

## Nets that join several sheets
+3v3: MainPlanSchDoc (NRF1.2 NRF1.3 P3.7), PowerPlan (C12.1 C14.1 U6.5)
+5v: MainPlanSchDoc (19 pins), PowerPlan (C6.2 F3.2 R3.1 U6.1)
GND: MainPlanSchDoc (37 pins), PowerPlan (31 pins)
Power_Input_FB: MainPlanSchDoc (U3.26), PowerPlan (C23.1 R2.1 R4.2)
USBD_N: MainPlanSchDoc (U1.2), PowerPlan (D2.1 R18.2)
USBD_P: MainPlanSchDoc (U1.1), PowerPlan (D2.2 R17.2)